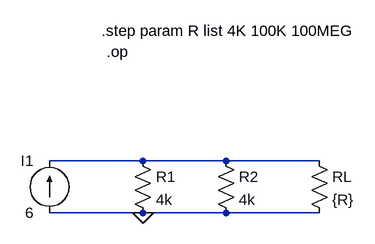
[diagram p0: schematic 1c.asc]
1c.asc, the LTspice schematic file:
Version 4
SHEET 1 880 680
WIRE 192 112 48 112
WIRE 320 112 192 112
WIRE 464 112 320 112
WIRE 192 192 48 192
WIRE 320 192 192 192
WIRE 464 192 320 192
FLAG 192 192 0
SYMBOL current 48 192 R180
WINDOW 0 24 80 Left 2
WINDOW 3 24 0 Left 2
WINDOW 123 0 0 Left 0
WINDOW 39 0 0 Left 0
SYMATTR InstName I1
SYMATTR Value 6
SYMBOL res 176 96 R0
SYMATTR InstName R1
SYMATTR Value 4k
SYMBOL res 304 96 R0
SYMATTR InstName R2
SYMATTR Value 4k
SYMBOL res 448 96 R0
SYMATTR InstName RL
SYMATTR Value {R}
TEXT 128 -88 Left 2 !.step param R list 4K 100K 100MEG
TEXT 136 -56 Left 2 !.op

The netlist it stands for:
* 1c.asc
I1 0 N001 6
R1 N001 0 4k
R2 N001 0 4k
RL N001 0 {R}
.step param R list 4K 100K 100MEG
.op
.backanno
.end